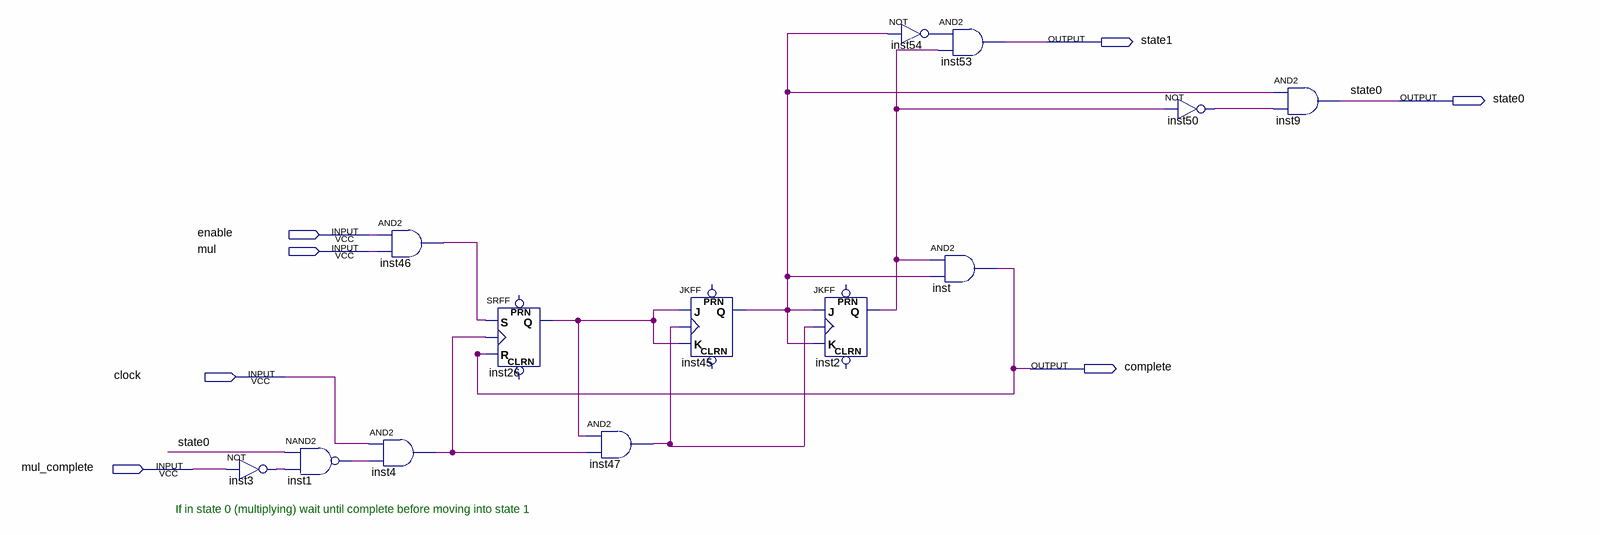
[diagram p0: schematic sheet]
// Quartus schematic mul_decode.bdf as structural Verilog: 13 symbols, 7 pins
module mul_decode (
  input  enable,
  input  mul,
  input  clock,
  input  mul_complete,
  output state1,
  output state0,
  output complete
);

  wire inst1_out, inst2_q, inst3_out, inst4_out, inst26_q, inst45_q, inst46_out, inst47_out, inst50_out,
       inst54_out;

  not inst3 (inst3_out, mul_complete);
  nand inst1 (inst1_out, state0, inst3_out);
  and inst4 (inst4_out, clock, inst1_out);
  and inst46 (inst46_out, enable, mul);
  SRFF inst26 (.S(inst46_out), .R(complete), .CLK(inst4_out), .Q(inst26_q));  // open: PRN, CLRN
  and inst47 (inst47_out, inst26_q, inst4_out);
  JKFF inst45 (.K(inst26_q), .J(inst26_q), .CLK(inst47_out), .Q(inst45_q));  // open: PRN, CLRN
  JKFF inst2 (.K(inst45_q), .J(inst45_q), .CLK(inst47_out), .Q(inst2_q));  // open: PRN, CLRN
  not inst54 (inst54_out, inst45_q);
  and inst53 (state1, inst54_out, inst2_q);
  and inst (complete, inst2_q, inst45_q);
  not inst50 (inst50_out, inst2_q);
  and inst9 (state0, inst45_q, inst50_out);

  // Notes on the sheet:
  //   If in state 0 (multiplying) wait until complete before moving into state 1
endmodule
